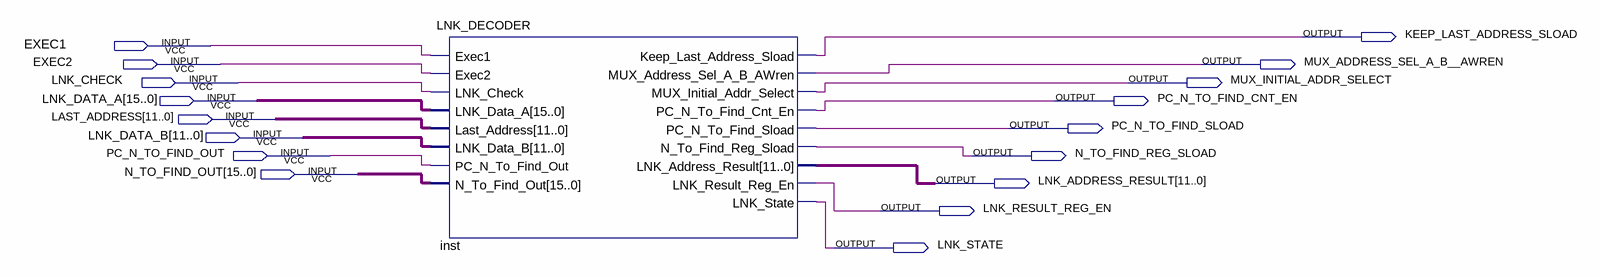
[diagram p0: schematic sheet]
// Quartus schematic LNK_Project_V1.bdf as structural Verilog: 1 symbols, 17 pins
module LNK_Project_V1 (
  input  EXEC1,
  input  EXEC2,
  input  LNK_CHECK,
  input  [15:0] LNK_DATA_A,
  input  [11:0] LAST_ADDRESS,
  input  [11:0] LNK_DATA_B,
  input  PC_N_TO_FIND_OUT,
  input  [15:0] N_TO_FIND_OUT,
  output KEEP_LAST_ADDRESS_SLOAD,
  output MUX_ADDRESS_SEL_A_B__AWREN,
  output MUX_INITIAL_ADDR_SELECT,
  output PC_N_TO_FIND_CNT_EN,
  output PC_N_TO_FIND_SLOAD,
  output N_TO_FIND_REG_SLOAD,
  output [11:0] LNK_ADDRESS_RESULT,
  output LNK_RESULT_REG_EN,
  output LNK_STATE
);

  LNK_DECODER inst (
    .Exec1(EXEC1), .Exec2(EXEC2), .LNK_Check(LNK_CHECK), .LNK_Data_A(LNK_DATA_A),
    .Last_Address(LAST_ADDRESS), .LNK_Data_B(LNK_DATA_B), .PC_N_To_Find_Out(PC_N_TO_FIND_OUT),
    .N_To_Find_Out(N_TO_FIND_OUT), .Keep_Last_Address_Sload(KEEP_LAST_ADDRESS_SLOAD),
    .MUX_Address_Sel_A_B_AWren(MUX_ADDRESS_SEL_A_B__AWREN),
    .MUX_Initial_Addr_Select(MUX_INITIAL_ADDR_SELECT), .PC_N_To_Find_Cnt_En(PC_N_TO_FIND_CNT_EN),
    .PC_N_To_Find_Sload(PC_N_TO_FIND_SLOAD), .N_To_Find_Reg_Sload(N_TO_FIND_REG_SLOAD),
    .LNK_Address_Result(LNK_ADDRESS_RESULT), .LNK_Result_Reg_En(LNK_RESULT_REG_EN), .LNK_State(LNK_STATE));
endmodule
